# EAGLE design AT261A_LDO (EAGLE 6.3)
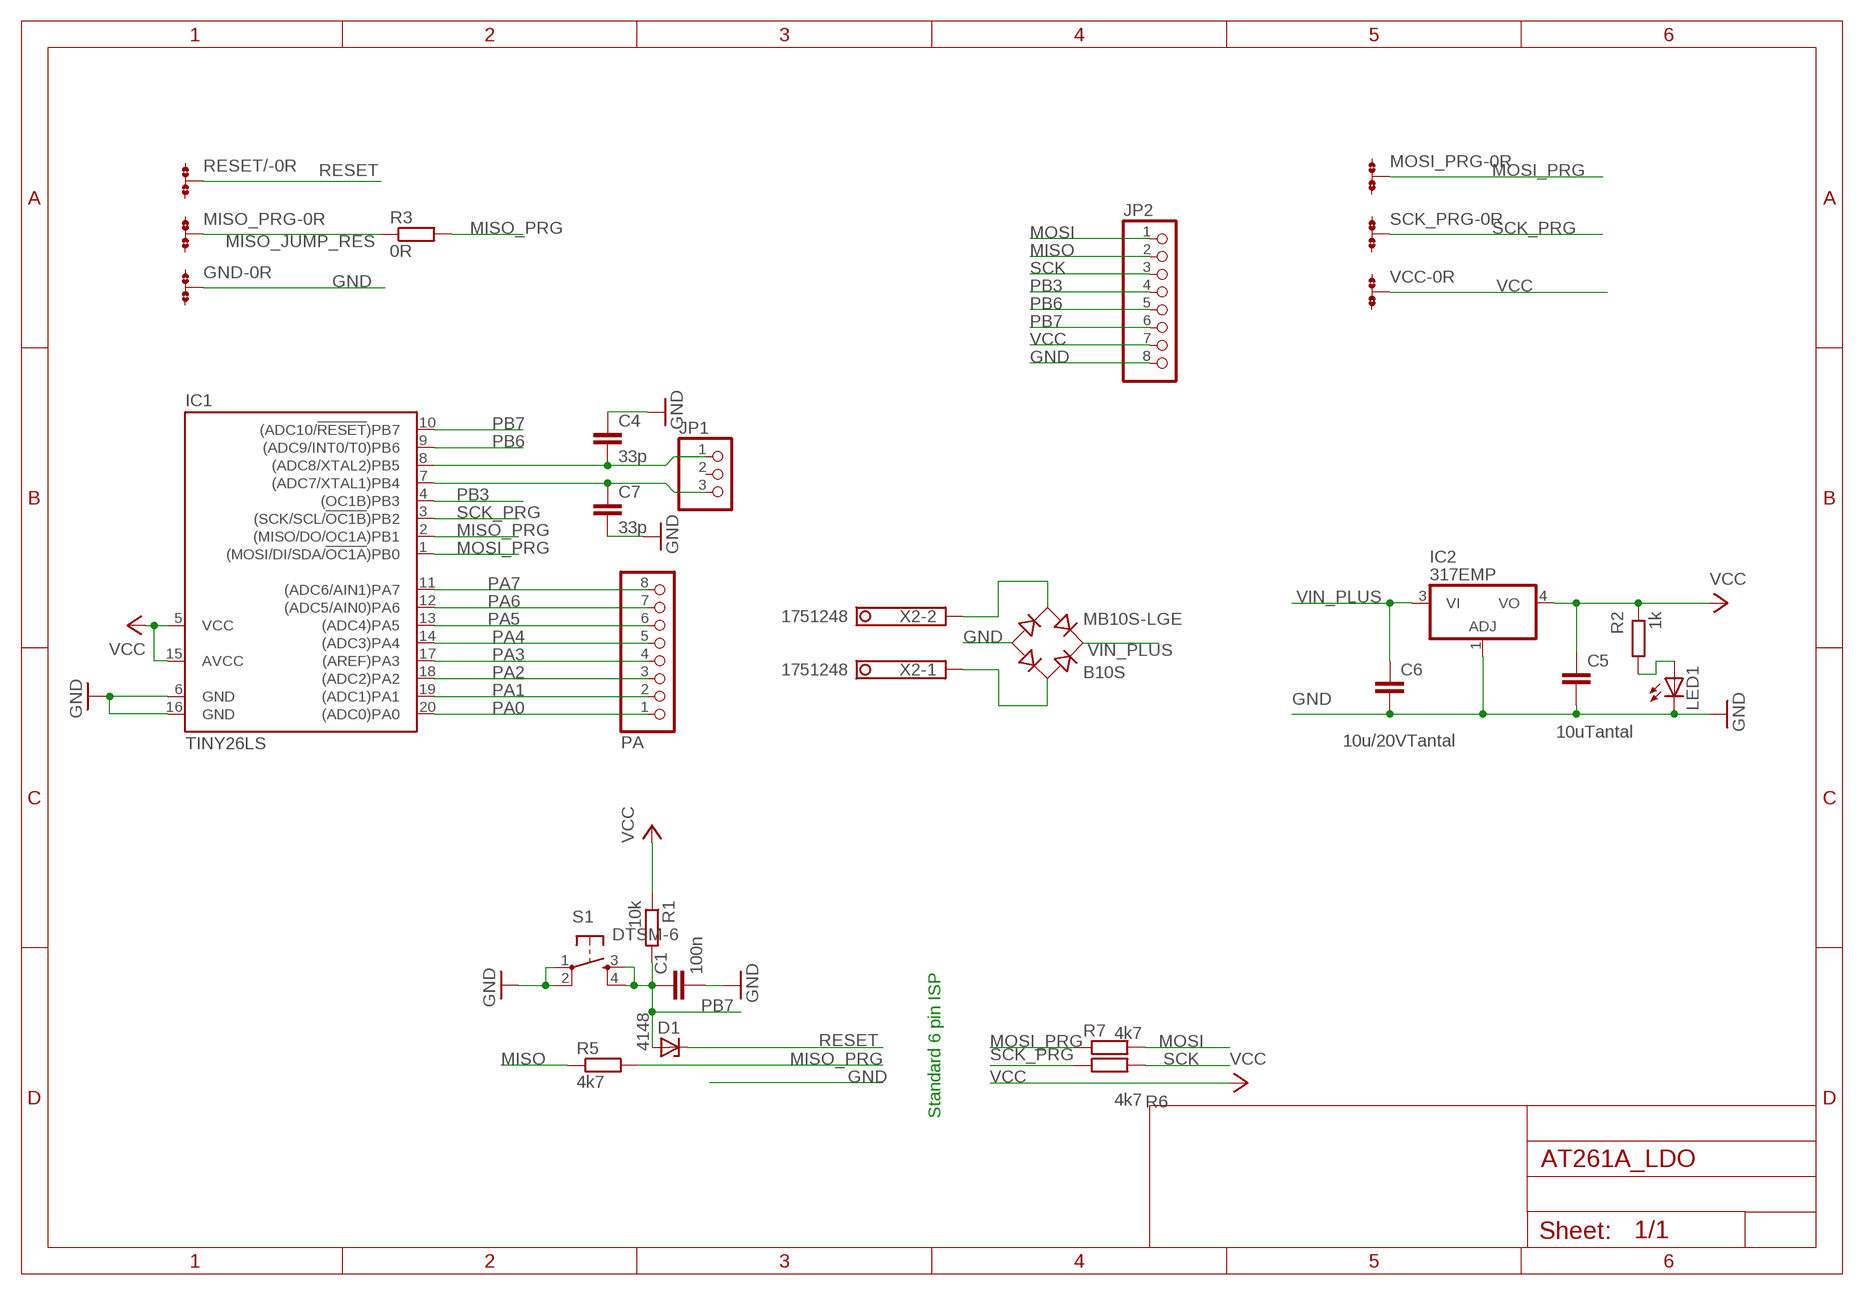
[diagram p0: schematic, sheet 1]

## Parts
C1  100n  C-EUC1206  [C1206]
C4  33p  C-EUC1206  [C1206]
C5  10uTantal  C-EUC1206K  [C1206K]
C6  10u/20VTantal  C-EUC1206K  [C1206K]
C7  33p  C-EUC1206  [C1206]
D1  4148  ZENER-DIODESMB  [SMB]
GND  0R-JUMPA  [A0R-JMP]
IC1  TINY26LS  [SO20L]
IC2  317EMP  [SOT223]
JP1  PINHD-1X3  [1X03]
JP2  PINHD-1X8/90  [1X08/90]
LED1  LEDSMT1206  [1206]
MB10S-LGE  B10S  [MBS]
MISO_PRG  0R-JUMPA  [A0R-JMP]
MOSI_PRG  0R-JUMPA  [A0R-JMP]
PA  PINHD-1X8/90  [1X08/90]
R1  10k  R-EU_R1206  [R1206]
R2  1k  R-EU_R1206  [R1206]
R3  0R  R-EU_M1406  [M1406]
R5  4k7  R-EU_R1206  [R1206]
R6  4k7  R-EU_R1206  [R1206]
R7  4k7  R-EU_R1206  [R1206]
RESET/  0R-JUMPA  [A0R-JMP]
S1  DTSM-6  [DTSM-6]
SCK_PRG  0R-JUMPA  [A0R-JMP]
VCC  0R-JUMPA  [A0R-JMP]
X2  1751248  [1751248]

## Nets
GND: C1.2 C4.1 C5.2 C6.2 C7.2 GND.2 IC1.6(GND) IC1.16(GND) IC2.1(ADJ) JP2.8 LED1.C MB10S-LGE.- S1.1 S1.2
MISO: JP2.2 R5.1
MISO_JUMP_RES: MISO_PRG.2 R3.1
MISO_PRG: IC1.2((MISO/DO/OC1A)PB1) R3.2 R5.2
MOSI: JP2.1 R7.2
MOSI_PRG: IC1.1((MOSI/DI/SDA/!OC1A!)PB0) MOSI_PRG.2 R7.1
N$1: C4.2 IC1.8((ADC8/XTAL2)PB5) JP1.1
N$3: C7.1 IC1.7((ADC7/XTAL1)PB4) JP1.3
N$4: LED1.A R2.1
PA0: IC1.20((ADC0)PA0) PA.1
PA1: IC1.19((ADC1)PA1) PA.2
PA2: IC1.18((ADC2)PA2) PA.3
PA3: IC1.17((AREF)PA3) PA.4
PA4: IC1.14((ADC3)PA4) PA.5
PA5: IC1.13((ADC4)PA5) PA.6
PA6: IC1.12((ADC5/AIN0)PA6) PA.7
PA7: IC1.11((ADC6/AIN1)PA7) PA.8
PB3: IC1.4((OC1B)PB3) JP2.4
PB6: IC1.9((ADC9/INT0/T0)PB6) JP2.5
PB7: C1.1 D1.A IC1.10((ADC10/!RESET!)PB7) JP2.6 R1.2 S1.3 S1.4
RESET: D1.C RESET/.2
SCK: JP2.3 R6.2
SCK_PRG: IC1.3((SCK/SCL/!OC1B!)PB2) R6.1 SCK_PRG.2
VCC: C5.1 IC1.5(VCC) IC1.15(AVCC) IC2.4(VO) JP2.7 R1.1 R2.2 VCC.2
VIN_A: MB10S-LGE.AC1 X2.2
VIN_B: MB10S-LGE.AC2 X2.1
VIN_PLUS: C6.1 IC2.3(VI) MB10S-LGE.+
Unconnected: GND.1 GND.3 JP1.2 MISO_PRG.1 MISO_PRG.3 MOSI_PRG.1 MOSI_PRG.3 RESET/.1 RESET/.3 SCK_PRG.1 SCK_PRG.3 VCC.1 VCC.3

## Notes on the sheet
- Standard 6 pin ISP

## Library data of the parts
C1 C4-C7 = rcl:C-EU: CAPACITOR, European symbol
D1 = diode:ZENER-DIODE: Z-Diode
GND MISO_PRG MOSI_PRG RESET/ SCK_PRG VCC = jump-0r-smd:0R-JUMP: SMD 0R 0805 Jumper
IC1 = atmel:TINY26*: 8-bit AVR Microcontroller with 2K Bytes Flash Source: http://www.atmel.com .. doc1477.pdf; MPN: ATTINY26L-8SU; OC_FARNELL: 9171665; OC_NEWARK: 01M6921
IC2 = linear:*317: Positive VOLTAGE REGULATOR
JP1 = pinhead:PINHD-1X3: PIN HEADER
JP2 PA = pinhead:PINHD-1X8: PIN HEADER
LED1 = led:LED: LED OSRAM: - CHIPLED LG R971, LG N971, LY N971, LG Q971, LY Q971, LO R971, LY R971 LH N974, LH R974 LS Q976, LO Q976, LY Q976 LO Q996 - Hyper CHIPLED LW Q18S LB Q993, LB Q99A, LB R99A - SideLED LS A670, LO A670, LY A670, LG A670, LP A670 LB A673, LV A673, LT A673, LW A673 LH A674 LY A675 LS A676, LA A676, LO A676, LY A676, LW A676 LS A679, LY A679, LG A679 - Hyper Micro SIDELED® LS Y876, LA Y876, LO Y876, LY Y876 LT Y87S - SmartLED LW L88C, LW L88S LB L89C, LB L89S, LG L890 LS L89K, LO L89K, LY L89K LS L896, LA L896, LO L896, LY L896 - TOPLED LS T670, LO T670, LY T670, LG T670, LP T670 LSG T670, LSP T670, LSY T670, LOP T670, LYG T670 LG T671, LOG T671, LSG T671 LB T673, LV T673, LT T673, LW T673 LH T674 LS T676, LA T676, LO T676, LY T676, LB T676, LH T676, LSB T676, LW T676 LB T67C, LV T67C, LT T67C, LS T67K, LO T67K, LY T67K, LW E67C LS E67B, LA E67B, LO E67B, LY E67B, LB E67C, LV E67C, LT E67C LW T67C LS T679, LY T679, LG T679 LS T770, LO T770, LY T770, LG T770, LP T770 LB T773, LV T773, LT T773, LW T773 LH T774 LS E675, LA E675, LY E675, LS T675 LS T776, LA T776, LO T776, LY T776, LB T776 LHGB T686 LT T68C, LB T68C - Hyper Mini TOPLED® LB M676 - Mini TOPLED Santana® LG M470 LS M47K, LO M47K, LY M47K Source: http://www.osram.convergy.de LUXEON: - LUMILED® LXK2-PW12-R00, LXK2-PW12-S00, LXK2-PW14-U00, LXK2-PW14-V00 LXK2-PM12-R00, LXK2-PM12-S00, LXK2-PM14-U00 LXK2-PE12-Q00, LXK2-PE12-R00, LXK2-PE12-S00, LXK2-PE14-T00, LXK2-PE14-U00 LXK2-PB12-K00, LXK2-PB12-L00, LXK2-PB12-M00, LXK2-PB14-N00, LXK2-PB14-P00, LXK2-PB14-Q00 LXK2-PR12-L00, LXK2-PR12-M00, LXK2-PR14-Q00, LXK2-PR14-R00 LXK2-PD12-Q00, LXK2-PD12-R00, LXK2-PD12-S00 LXK2-PH12-R00, LXK2-PH12-S00 LXK2-PL12-P00, LXK2-PL12-Q00, LXK2-PL12-R00 Source: www.luxeon.com KINGBRIGHT: KA-3528ASYC Source: www.kingbright.com
MB10S-LGE = rectifier:B*S: Surface Mount Glass Passivated Bridge Rectifiers Source: Comchip Bridge Rectifiers B05S-G_B10S-G.pdf
R1 R5-R7 = rcl:R-EU_: RESISTOR, European symbol
R2 R3 = resistor:R-EU_: RESISTOR, European symbol
S1 = switch-tact:DTSM-6
X2 = con-phoenix-350:1751248: MKDS 1/ 2-3,5 Printklemme Nennstrom: 10 A Bemessungsspannung: 160 V Raster: 3,5 mm Polzahl: 2 Montageart: Löten Anschlussart: Schraubanschluss Anschlussrichtung vom Leiter zur Platine: 0° Source: http://eshop.phoenixcontact.com .. 1751248.pdf; OC_FARNELL: unknown; OC_NEWARK: unknown

## Board
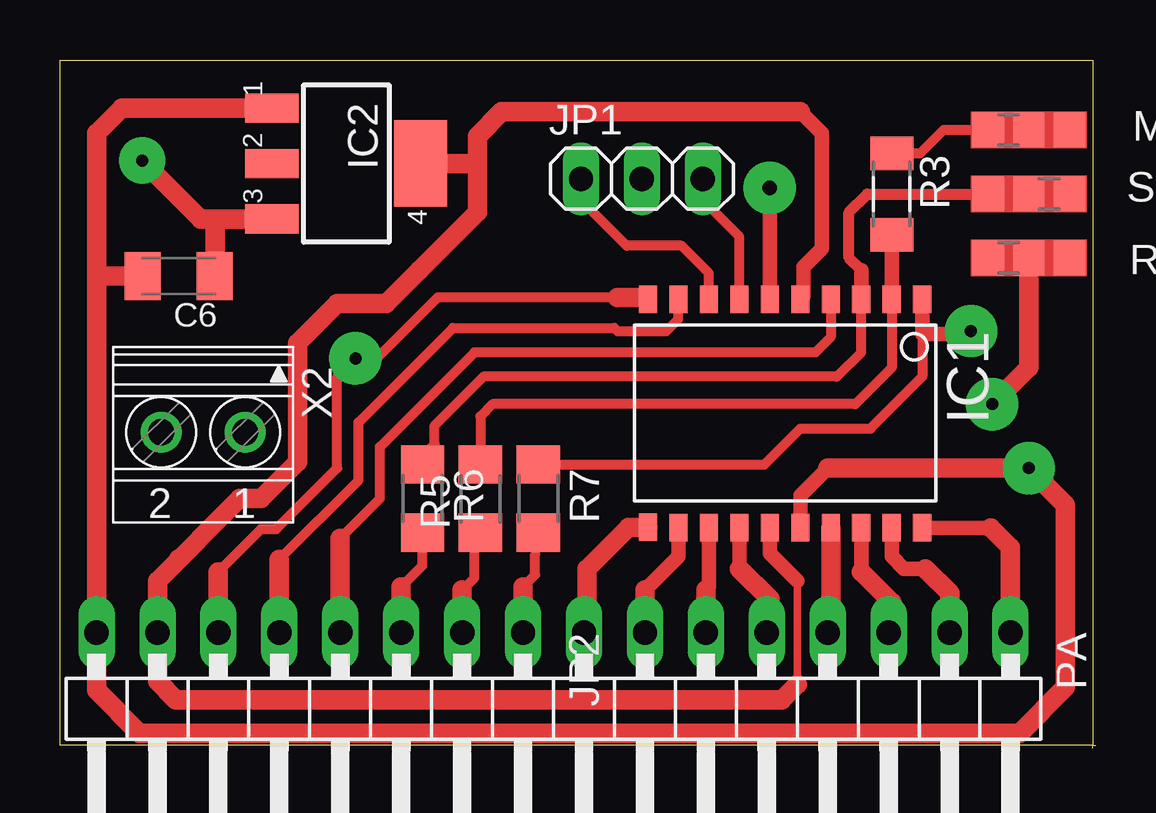
[diagram p1: board, top side]
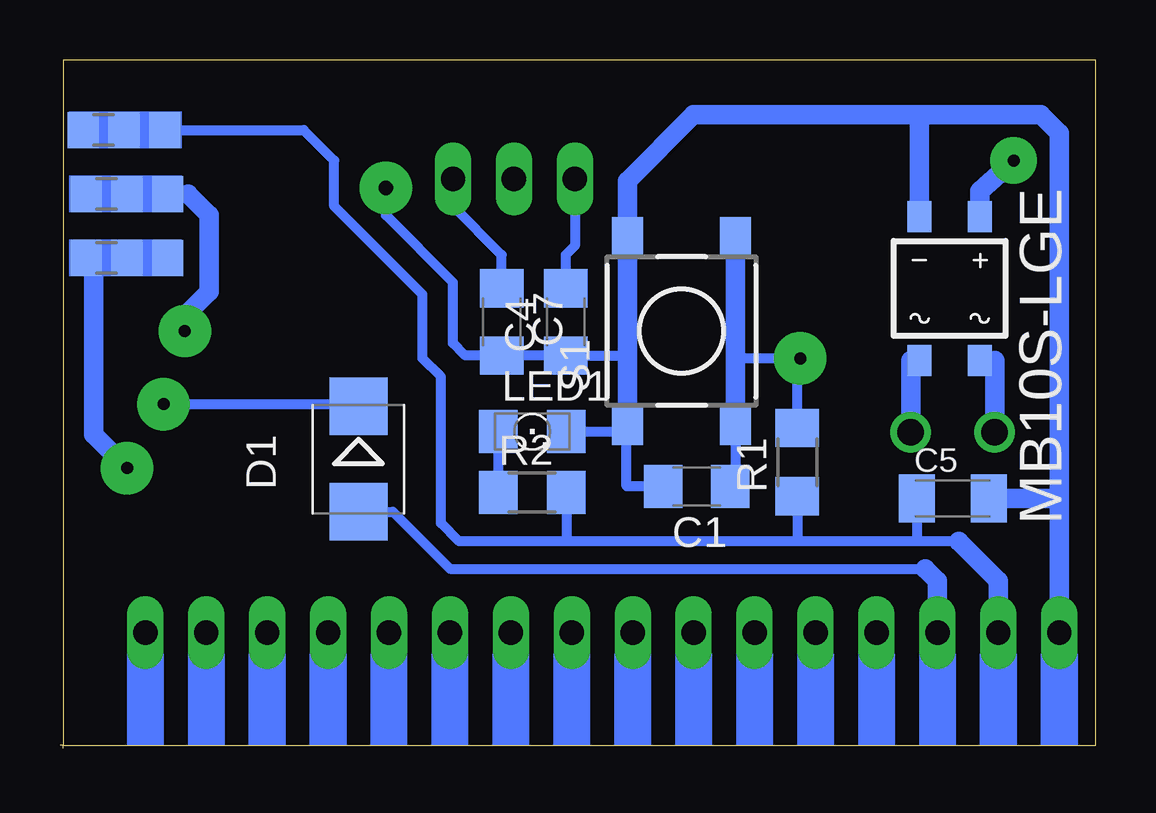
[diagram p2: board, bottom side, seen from below]

Size 43.18 x 28.7 mm. Coordinates in mm from the lower left corner, seen from the top.
Outline: 43.05,0 43.05,0.13
Outline: 43.05,0.13 0,0.13 0,28.7 43.05,28.7 43.05,0.13
Outline: 43.05,0.13 43.18,0.13
Copper layers (1*16): Top 0.035mm / dielectric 1.5mm / Bottom 0.035mm
Design rules "default": minimum track width 10mil, minimum drill 24mil, track to track 8mil, track to pad 8mil, pad to pad 8mil, via to via 8mil, smd to smd 8mil, copper to edge 40mil, drill to drill 8mil, minimum pad ring 10mil, minimum via ring 8mil, stop-mask expansion 4mil, vias tented up to drill 0mil, thermal gap 10mil

### Footprints (pad centres in the part's own frame; a part is rotated, then mirrored left to right if it is on the bottom)
C1206 = smd 1.6 x 1.8: 1 -1.4,0; 2 1.4,0
C1206K = smd 1.5 x 2: 1 -1.5,0; 2 1.5,0
SMB = smd 2.4 x 2.4: A 2.2,0; C -2.2,0
A0R-JMP = smd 1.5 x 1.3: 1 0,1.7; 2 0,0; 3 0,-1.7
SO20L = smd 0.762 x 1.143: 1 -5.08,-5.131; 2 -3.81,-5.131; 3 -2.54,-5.131; 4 -1.27,-5.131; 5 0,-5.131; 6 1.27,-5.131; 7 2.54,-5.131; 8 3.81,-5.131; 9 5.08,-5.131; 10 6.35,-5.131; 11 6.35,4.369; 12 5.08,4.394; 13 3.81,4.394; 14 2.54,4.394; 15 1.27,4.394; 16 0,4.394; 17 -1.27,4.394; 18 -2.54,4.394; 19 -3.81,4.394; 20 -5.08,4.394
SOT223 = smd 1.219 x 2.235: 1 -2.311,-3.099; 2 0,-3.099; 3 2.311,-3.099 | smd 3.6 x 2.2: 4 0,3.099
1X03 = drill 1.016 long: 1 -2.54,0; 2 0,0; 3 2.54,0
1X08/90 = drill 1.016 long: 1 -8.89,-3.81; 2 -6.35,-3.81; 3 -3.81,-3.81; 4 -1.27,-3.81; 5 1.27,-3.81; 6 3.81,-3.81; 7 6.35,-3.81; 8 8.89,-3.81
1206 = smd 1.6 x 1.803: A -1.422,0; C 1.422,0
MBS = smd 1 x 1.3: + -1.27,-3; - 1.27,-3; AC1 -1.27,3; AC2 1.27,3
R1206 = smd 1.6 x 1.803: 1 -1.422,0; 2 1.422,0
M1406 = smd 1.4 x 1.8: 1 -1.7,0; 2 1.7,0
DTSM-6 = smd 1.55 x 1.3: 1 -3.975,2.25; 2 3.975,2.25; 3 -3.975,-2.25; 4 3.975,-2.25
1751248 = drill 1.1 pad 1.7: 1 -1.75,-0.1; 2 1.75,-0.1

### Placement (x,y rotation side)
C1  16.64,10.92 180 bottom
C4  22.1,17.78 90 bottom
C5  5.97,10.41 0 bottom
C6  4.95,19.68 180 top
C7  24.77,17.78 270 bottom
D1  30.73,12.07 270 bottom
GND  40.39,20.45 90 bottom
IC1  30.86,13.59 180 top
IC2  11.94,24.38 270 top
JP1  24.26,23.75 0 top
JP2  10.41,1.02 180 top
LED1  23.5,13.21 0 bottom
MB10S-LGE  6.1,19.18 180 bottom
MISO_PRG  40.39,25.78 90 top
MOSI_PRG  40.39,23.11 90 bottom
PA  30.73,1.02 180 top
R1  12.45,11.94 90 bottom
R2  23.5,10.67 0 bottom
R3  34.67,23.11 270 top
R5  17.53,10.41 90 top
R6  15.11,10.41 270 top
R7  19.94,10.41 270 top
RESET/  40.39,20.45 90 top
S1  17.27,17.4 90 bottom
SCK_PRG  40.39,23.11 270 top
VCC  40.51,25.78 90 bottom
X2  5.97,13.08 180 top

### Tracks (layer width: path | path; a pad name or v marks a point on that pad's centre or on a via)
GND  (via drill 0.5 pad 2.18, 0.6 pad 2.18)
  Top 0.406: 1.55,14.5 1.52,14.48 | 1.65,15.37 1.52,15.24
  Top 0.61: IC1.16 30.86,10.54 32,11.68 | IC1.6 v29.59,23.37
  Top 0.813: 32,11.68 v40.39,11.68 41.91,10.16 41.91,2.54 40.01,0.64 3.3,0.64 1.52,2.41 JP2.8 1.52,14.48 1.52,15.24 1.52,19.68 | 1.52,19.68 C6.2 | IC2.1 2.56,26.7 1.52,25.65 1.52,19.68
  Bottom 0.254: JP2.8 1.52,8.76
  Bottom 0.406: 1.65,19.81 1.52,19.68 | 1.57,9.7 1.52,9.65 | S1.1 19.78,13.68 19.11,13.02 | S1.1 19.56,13.39 19.56,10.92 C1.2 | v29.59,23.37 29.59,22.22 26.8,19.43 26.8,16.89 26.29,16.38 C7.2 C4.1 19.65,16.38 19.52,16.26 | LED1.C 19.74,13.21 S1.1
  Bottom 0.813: 1.52,10.41 1.52,19.68 1.52,25.65 2.29,26.42 7.37,26.42 | 1.52,10.41 1.52,9.65 JP2.8 | S1.1 19.52,16.26 S1.2 19.52,23.66 16.76,26.42 7.37,26.42 | MB10S-LGE.- 7.37,26.42 | C5.2 1.52,10.41 | v40.39,11.68 41.78,13.08 41.78,20.32 41.66,20.45 GND.2
MISO
  Top 0.254: 17.27,8.1 R5.1
  Top 0.406: 16.76,6.6 17.27,7.11 17.27,8.1
  Top 0.813: JP2.2 16.76,6.6
MISO_JUMP_RES
  Top 0.406: R3.1 35.86,24.81 36.83,25.78 MISO_PRG.2
MISO_PRG
  Top 0.406: IC1.2 34.67,15.88 33.15,14.35 18.03,14.35 17.53,13.84 R5.2
  Top 0.61: IC1.2 R3.2
MOSI
  Top 0.254: 19.81,8.1 R7.2
  Top 0.406: 19.3,6.73 19.81,7.24 19.81,8.1
  Top 0.813: JP2.1 19.3,6.73
MOSI_PRG  (via drill 0.5 pad 2.18)
  Top 0.406: 35.94,17.27 35.94,15.49 33.78,13.34 30.86,13.34 29.36,11.84 R7.1 | 36.02,18.8 IC1.1 | v37.97,17.4 37.85,17.27
  Top 0.61: IC1.1 35.94,17.27 37.85,17.27
  Bottom 0.406: MOSI_PRG.2 37.85,23.11 | 37.97,18.03 v37.97,17.4
  Bottom 0.813: 37.85,23.11 36.96,22.22 36.96,19.05 37.97,18.03
N$1
  Top 0.406: IC1.8 27.05,19.81 25.91,20.95 23.62,20.95 21.72,22.86 JP1.1
  Bottom 0.406: JP1.1 21.72,20.95 22.1,20.57 C4.2
N$3
  Top 0.406: IC1.7 28.32,21.34 26.8,22.86 JP1.3
  Bottom 0.406: JP1.3 26.8,22.61 24.77,20.57 C7.1
N$4
  Bottom 0.406: LED1.A R2.1
PA0
  Top 0.406: PA.1 39.62,5.97
  Top 0.61: IC1.20 38.81,9.2
  Top 0.813: 38.81,9.2 39.62,8.38 PA.1
PA1
  Top 0.61: IC1.19 34.67,8 35.18,7.49 36.07,7.49
  Top 0.813: PA.2 37.08,6.48 36.07,7.49
PA2
  Top 0.61: IC1.18 33.4,7.37
  Top 0.813: PA.3 34.67,4.95 34.67,6.1 33.4,7.37
PA3
  Top 0.406: 32.13,4.95 PA.4
  Top 0.813: IC1.17 32.13,4.95
PA4
  Top 0.254: 29.59,6.35 29.59,6.22
  Top 0.406: 29.59,4.95 PA.5
  Top 0.61: IC1.14 28.32,7.49
  Top 0.813: 29.59,4.95 29.59,6.22 28.32,7.49
PA5
  Top 0.254: 26.92,5.71 PA.6
  Top 0.305: 27.05,6.73 26.92,6.6
  Top 0.61: IC1.13 27.05,6.73
  Top 0.813: 26.92,6.6 PA.6
PA6
  Top 0.61: IC1.12 25.78,8 24.38,6.6
  Top 0.813: 24.38,6.6 PA.7
PA7
  Top 0.254: 21.97,6.6 21.97,4.95
  Top 0.305: 21.97,4.95 PA.8
  Top 0.813: IC1.11 23.7,9.22 21.97,7.49 21.97,4.95
PB3
  Top 0.406: IC1.4 32.13,17.14 31.5,16.51 17.27,16.51 13.34,12.57 13.34,10.41 11.68,8.76
  Top 0.813: 11.68,8.76 JP2.4
PB6
  Top 0.406: 9.14,7.87 12.45,11.18 12.45,13.59 16.38,17.53 23.11,17.53 23.24,17.4 25.27,17.4 25.78,17.91 IC1.9
  Top 0.813: JP2.5 9.14,7.87
PB7  (via drill 0.5 pad 2.18)
  Top 0.254: 24.43,18.8 IC1.10
  Top 0.406: 23.24,18.8 15.75,18.8 13.21,16.26 v12.32,16.26 11.56,15.49 11.56,11.68 9.02,9.14 8.38,9.14 6.6,7.37
  Top 0.813: 23.24,18.8 24.43,18.8 | JP2.6 6.6,7.37
  Bottom 0.406: 7.11,7.49 26.92,7.49 29.3,9.87 D1.A | S1.3 15.02,11.39 C1.1 | 15.02,16.38 14.89,16.26 v12.32,16.26 12.45,16.13 R1.2
  Bottom 0.813: 7.11,7.49 6.6,6.98 JP2.6 | S1.4 15.02,16.38 S1.3
RESET  (via drill 0.5 pad 2.18)
  Top 0.813: RESET/.2 40.39,15.88 v38.86,14.35
  Bottom 0.406: v38.86,14.35 30.82,14.35 D1.C
SCK
  Top 0.406: 14.22,6.73 15.11,7.62 R6.2
  Top 0.813: JP2.3 14.22,6.73
SCK_PRG
  Top 0.406: IC1.3 33.4,16.51 32.38,15.49 17.65,15.49 15.62,13.46 15.62,12.7 15.11,12.19 R6.1
  Top 0.45: SCK_PRG.2 33.66,23.11 32.89,22.35 32.89,20.45 33.4,19.94
  Top 0.61: IC1.3 33.4,19.94
VCC
  Top 0.254: 30.99,18.85 IC1.5
  Top 0.305: 30.73,6.98 30.73,2.67
  Top 0.406: 4.95,7.9 4.06,7.01 JP2.7
  Top 0.61: 30.99,18.85 30.99,20.07 31.75,20.83 31.75,25.65 30.87,26.54 | IC1.15 29.59,8.13 30.73,6.98
  Top 0.813: 30.73,2.67 30.1,2.03 4.83,2.03 4.06,2.79 JP2.7 4.06,6.98 7.49,10.41 8.38,10.41 9.91,11.94 9.91,16.89 11.56,18.54 13.59,18.54 14.99,19.94 17.4,22.35 17.4,24.38 | 30.87,26.54 18.41,26.54 17.4,25.52 17.4,24.38 | 4.95,7.9 4.95,7.87 | IC2.4 17.4,24.38
  Bottom 0.406: 5.71,8.64 7.49,8.64 | 7.49,8.64 12.45,8.64 | 12.45,8.64 22.1,8.64 | R2.2 22.07,8.66 22.1,8.64 | 22.1,8.64 26.54,8.64 27.3,9.4 27.3,15.49 28.07,16.26 28.07,18.92 31.75,22.61 31.75,24.51 33.02,25.78 VCC.2 | R1.1 12.45,8.64 | C5.1 7.47,8.66 7.49,8.64
  Bottom 0.813: JP2.7 4.06,6.98 5.71,8.64
VIN_A
  Bottom 0.406: MB10S-LGE.AC1 4.22,16.18
  Bottom 0.813: 4.22,16.18 X2.2
VIN_B
  Bottom 0.406: MB10S-LGE.AC2 7.72,16.18
  Bottom 0.813: 7.72,16.18 X2.1
VIN_PLUS  (via drill 0.5 pad 1.93)
  Top 0.406: C6.1 6.48,19.71
  Top 0.813: v3.43,24.51 5.87,22.07 6.48,22.07 | 6.48,22.07 IC2.3 | 6.48,19.71 6.48,22.07
  Bottom 0.813: v3.43,24.51 4.83,23.24 MB10S-LGE.+
(copper drawn outside any net)
  shapes: Bottom area x19, Top area x3